# EAGLE board breakout_spartan6 (EAGLE 5.12)
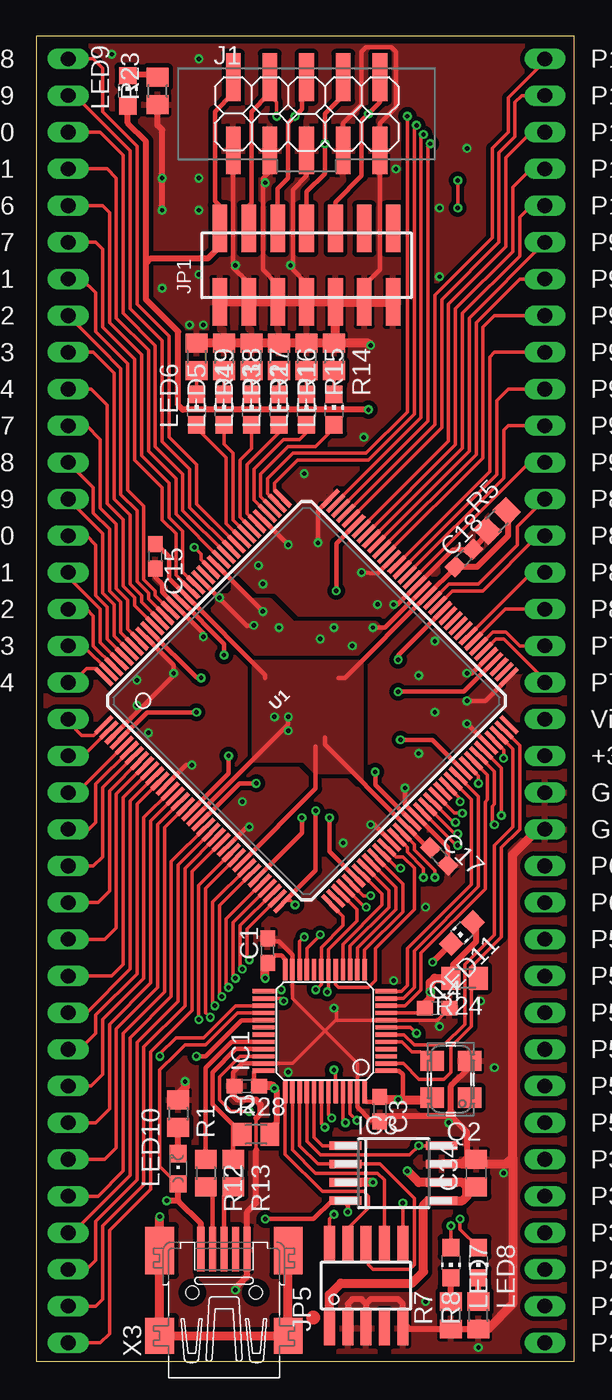
[diagram p4: board, top side]
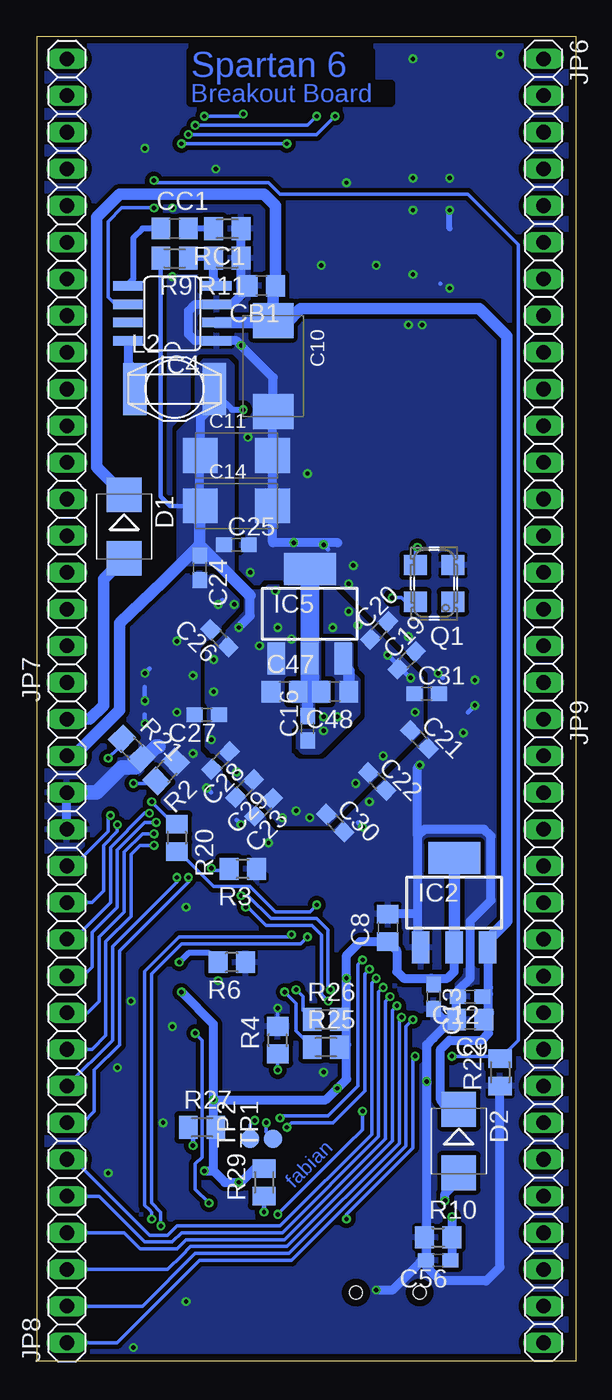
[diagram p5: board, bottom side, seen from below]

Size 37.29 x 91.75 mm. Coordinates in mm from the lower left corner, seen from the top.
Outline: 0,0 37.29,0 37.29,91.75 0,91.75 0,0
Copper layers (1*16): Top 0.035mm / dielectric 1.5mm / Bottom 0.035mm
Design rules "PCB-POOL": minimum track width 6mil, minimum drill 12mil, track to track 6mil, track to pad 6mil, pad to pad 6mil, via to via 6mil, smd to smd 6mil, copper to edge 20mil, drill to drill 8mil, minimum pad ring 8mil, minimum via ring 6mil, stop-mask expansion 3mil, vias tented up to drill 0mil, thermal gap 8mil

## Footprints (pad centres in the part's own frame; a part is rotated, then mirrored left to right if it is on the bottom)
C0603 = smd 1.1 x 1: 1 -0.85,0; 2 0.85,0
C0805 = smd 1.3 x 1.5: 1 -0.95,0; 2 0.95,0
SMC_D = smd 2.4 x 2.8: + -3.15,0; - 3.15,0
SMC_C = smd 2.4 x 2.4: + -2.5,0; - 2.5,0
SMB = smd 2.4 x 2.4: A 2.2,0; C -2.2,0
TQFP48 = smd 0.3 x 1.5: 1 -2.75,-4.25; 2 -2.25,-4.25; 3 -1.75,-4.25; 4 -1.25,-4.25; 5 -0.75,-4.25; 6 -0.25,-4.25; 7 0.25,-4.25; 8 0.75,-4.25; 9 1.25,-4.25; 10 1.75,-4.25; 11 2.25,-4.25; 12 2.75,-4.25; 25 2.75,4.25; 26 2.25,4.25; 27 1.75,4.25; 28 1.25,4.25; 29 0.75,4.25; 30 0.25,4.25; 31 -0.25,4.25; 32 -0.75,4.25; 33 -1.25,4.25; 34 -1.75,4.25; 35 -2.25,4.25; 36 -2.75,4.25 | smd 1.5 x 0.3: 13 4.25,-2.75; 14 4.25,-2.25; 15 4.25,-1.75; 16 4.25,-1.25; 17 4.25,-0.75; 18 4.25,-0.25; 19 4.25,0.25; 20 4.25,0.75; 21 4.25,1.25; 22 4.25,1.75; 23 4.25,2.25; 24 4.25,2.75; 37 -4.25,2.75; 38 -4.25,2.25; 39 -4.25,1.75; 40 -4.25,1.25; 41 -4.25,0.75; 42 -4.25,0.25; 43 -4.25,-0.25; 44 -4.25,-0.75; 45 -4.25,-1.25; 46 -4.25,-1.75; 47 -4.25,-2.25; 48 -4.25,-2.75
SOT223 = smd 1.219 x 2.235: 1 -2.311,-3.099; 2 0,-3.099; 3 2.311,-3.099 | smd 3.6 x 2.2: 4 0,3.099
SO-08M = smd 0.6 x 2.2: 1 -1.905,-3.33; 2 -0.635,-3.33; 3 0.635,-3.33; 4 1.905,-3.33; 5 1.905,3.33; 6 0.635,3.33; 7 -0.635,3.33; 8 -1.905,3.33
SO08 = smd 0.66 x 2.032: 1 -1.905,-3.073; 2 -0.635,-3.073; 3 0.635,-3.073; 4 1.905,-3.073; 5 1.905,3.073; 6 0.635,3.073; 7 -0.635,3.073; 8 -1.905,3.073
2X05SMD = smd 1.016 x 3.302: 1 -5.08,-2.54; 2 -5.08,2.54; 3 -2.54,-2.54; 4 -2.54,2.54; 5 0,-2.54; 6 0,2.54; 7 2.54,-2.54; 8 2.54,2.54; 9 5.08,-2.54; 10 5.08,2.54
2X07M_SMD = smd 1.016 x 3.302: 1 -6,-2.54; 2 -6,2.54; 3 -4,-2.54; 4 -4,2.54; 5 -2,-2.54; 6 -2,2.54; 7 0,-2.54; 8 0,2.54; 9 2,-2.54; 10 2,2.54; 11 4,-2.54; 12 4,2.54; 13 6,-2.54; 14 6,2.54
1365-10 = smd 0.76 x 2.4: 1 -2.54,-2.95; 2 -2.54,2.95; 3 -1.27,-2.95; 4 -1.27,2.95; 5 0,-2.95; 6 0,2.95; 7 1.27,-2.95; 8 1.27,2.95; 9 2.54,-2.95; 10 2.54,2.95
1X18 = drill 1.016 long: 1 -21.59,0; 2 -19.05,0; 3 -16.51,0; 4 -13.97,0; 5 -11.43,0; 6 -8.89,0; 7 -6.35,0; 8 -3.81,0; 9 -1.27,0; 10 1.27,0; 11 3.81,0; 12 6.35,0; 13 8.89,0; 14 11.43,0; 15 13.97,0; 16 16.51,0; 17 19.05,0; 18 21.59,0
L-PISG = smd 1.6 x 3.6: 1 -2.75,0; 2 2.75,0
CHIP-LED0805 = smd 1.2 x 1.2: A 0,-1.05; C 0,1.05
CHIPLED_0805 = smd 1.2 x 1.2: A 0,-1.05; C 0,1.05
XO53_SMALL = smd 1.4 x 1.6: 1 -1.27,-1.3; 2 1.27,-1.3; 3 1.27,1.3; 4 -1.27,1.3
R0805 = smd 1.3 x 1.5: 1 -0.95,0; 2 0.95,0
M0805 = smd 1.3 x 1.6: 1 -0.95,0; 2 0.95,0
B1,27 = smd 1.27 x 1.27: TP 0,0
TQ144 = smd 1.6 x 0.3: P1 -11.1,8.75; P2 -11.1,8.25; P3 -11.1,7.75; P4 -11.1,7.25; P5 -11.1,6.75; P6 -11.1,6.25; P7 -11.1,5.75; P8 -11.1,5.25; P9 -11.1,4.75; P10 -11.1,4.25; P11 -11.1,3.75; P12 -11.1,3.25; P13 -11.1,2.75; P14 -11.1,2.25; P15 -11.1,1.75; P16 -11.1,1.25; P17 -11.1,0.75; P18 -11.1,0.25; P19 -11.1,-0.25; P20 -11.1,-0.75; P21 -11.1,-1.25; P22 -11.1,-1.75; P23 -11.1,-2.25; P24 -11.1,-2.75; P25 -11.1,-3.25; P26 -11.1,-3.75; P27 -11.1,-4.25; P28 -11.1,-4.75; P29 -11.1,-5.25; P30 -11.1,-5.75; P31 -11.1,-6.25; P32 -11.1,-6.75; P33 -11.1,-7.25; P34 -11.1,-7.75; P35 -11.1,-8.25; P36 -11.1,-8.75; P73 11.1,-8.75; P74 11.1,-8.25; P75 11.1,-7.75; P76 11.1,-7.25; P77 11.1,-6.75; P78 11.1,-6.25; P79 11.1,-5.75; P80 11.1,-5.25; P81 11.1,-4.75; P82 11.1,-4.25; P83 11.1,-3.75; P84 11.1,-3.25; P85 11.1,-2.75; P86 11.1,-2.25; P87 11.1,-1.75; P88 11.1,-1.25; P89 11.1,-0.75; P90 11.1,-0.25; P91 11.1,0.25; P92 11.1,0.75; P93 11.1,1.25; P94 11.1,1.75; P95 11.1,2.25; P96 11.1,2.75; P97 11.1,3.25; P98 11.1,3.75; P99 11.1,4.25; P100 11.1,4.75; P101 11.1,5.25; P102 11.1,5.75; P103 11.1,6.25; P104 11.1,6.75; P105 11.1,7.25; P106 11.1,7.75; P107 11.1,8.25; P108 11.1,8.75 | smd 0.3 x 1.6: P37 -8.75,-11.1; P38 -8.25,-11.1; P39 -7.75,-11.1; P40 -7.25,-11.1; P41 -6.75,-11.1; P42 -6.25,-11.1; P43 -5.75,-11.1; P44 -5.25,-11.1; P45 -4.75,-11.1; P46 -4.25,-11.1; P47 -3.75,-11.1; P48 -3.25,-11.1; P49 -2.75,-11.1; P50 -2.25,-11.1; P51 -1.75,-11.1; P52 -1.25,-11.1; P53 -0.75,-11.1; P54 -0.25,-11.1; P55 0.25,-11.1; P56 0.75,-11.1; P57 1.25,-11.1; P58 1.75,-11.1; P59 2.25,-11.1; P60 2.75,-11.1; P61 3.25,-11.1; P62 3.75,-11.1; P63 4.25,-11.1; P64 4.75,-11.1; P65 5.25,-11.1; P66 5.75,-11.1; P67 6.25,-11.1; P68 6.75,-11.1; P69 7.25,-11.1; P70 7.75,-11.1; P71 8.25,-11.1; P72 8.75,-11.1; P109 8.75,11.1; P110 8.25,11.1; P111 7.75,11.1; P112 7.25,11.1; P113 6.75,11.1; P114 6.25,11.1; P115 5.75,11.1; P116 5.25,11.1; P117 4.75,11.1; P118 4.25,11.1; P119 3.75,11.1; P120 3.25,11.1; P121 2.75,11.1; P122 2.25,11.1; P123 1.75,11.1; P124 1.25,11.1; P125 0.75,11.1; P126 0.25,11.1; P127 -0.25,11.1; P128 -0.75,11.1; P129 -1.25,11.1; P130 -1.75,11.1; P131 -2.25,11.1; P132 -2.75,11.1; P133 -3.25,11.1; P134 -3.75,11.1; P135 -4.25,11.1; P136 -4.75,11.1; P137 -5.25,11.1; P138 -5.75,11.1; P139 -6.25,11.1; P140 -6.75,11.1; P141 -7.25,11.1; P142 -7.75,11.1; P143 -8.25,11.1; P144 -8.75,11.1
32005-201 = smd 3.1 x 0.5: 1 3,1.6; 2 3,0.8; 3 3,0; 4 3,-0.8; 5 3,-1.6 | smd 2.5 x 2: M1 -3,-4.45; M2 -3,4.45 | smd 3.3 x 2: M3 2.9,4.45; M4 2.9,-4.45 | hole 0.9: 0,2.2; 0,-2.2

## Placement (x,y rotation side)
C1  100n  [C0603]  16.03,28.42 90 top
C2  100n  [C0603]  14.6,19.05 180 top
C3  100n  [C0603]  23.81,17.46 270 top
C4  100n  [C0603]  27.78,24.45 0 top
C8  1µ  [C0805]  13.02,30 90 bottom
C9  1µ  [C0805]  7.3,23.65 180 bottom
C10  22µ  [SMC_D]  20.95,68.9 270 bottom
C11  22µ  [SMC_C]  23.49,62.71 0 bottom
C12  100n  [C0603]  7.3,25.24 180 bottom
C13  100n  [C0603]  9.84,25.24 270 bottom
C14  22µ  [SMC_C]  23.49,59.21 0 bottom
C15  100n  [C0603]  8.26,55.72 270 top
C16  100n  [C0603]  18.57,43.82 90 bottom
C17  100n  [C0603]  27.92,34.94 315 top
C18  100n  [C0603]  29.64,55.61 45 top
C19  100n  [C0603]  11.7,48.53 45 bottom
C20  100n  [C0603]  13.61,50.59 45 bottom
C21  100n  [C0603]  10.81,43.04 315 bottom
C22  100n  [C0603]  13.75,40.14 315 bottom
C23  100n  [C0603]  21.62,38.35 225 bottom
C24  100n  [C0603]  26.03,54.93 270 bottom
C25  100n  [C0603]  23.5,56.52 0 bottom
C26  100n  [C0603]  24.68,50.05 135 bottom
C27  100n  [C0603]  25.56,44.77 180 bottom
C28  100n  [C0603]  24.61,41.59 225 bottom
C29  100n  [C0603]  22.93,39.65 225 bottom
C30  100n  [C0603]  16.65,37.26 315 bottom
C31  100n  [C0603]  10.32,46.2 0 bottom
C34  100n  [C0805]  30.48,13.02 90 top
C47  4µ7  [C0805]  20.16,46.35 0 bottom
C48  1µ  [C0805]  16.67,46.35 180 bottom
C56  10n  [C0603]  9.52,6.99 180 bottom
CB1  100n  [C0805]  21.75,74.45 180 bottom
CC1  6n8  [C0805]  27.78,78.42 0 bottom
D1  MBRS140  [SMB]  31.27,57.79 270 bottom
D2  MBRS140  [SMB]  8.1,15.24 270 bottom
IC1  STM32F10XCXT6  [TQFP48]  20,22.86 90 top
IC2  LM1117  [SOT223]  8.41,31.75 0 bottom
IC3  AT45DB161D-SU  [SO-08M]  24.77,13.02 270 top
IC4  NCP3170  [SO08]  27.94,72.55 90 bottom
IC5  MCP1825S-1202E/DB  [SOT223]  18.42,51.75 0 bottom
J1  XILINX_JTAGSMD  [2X05SMD]  18.73,86.36 0 top
JP1  [2X07M_SMD]  18.73,75.88 0 top
JP5  CORTEX_JTAG_1.27  [1365-10]  22.86,5.24 0 top
JP6  [1X18]  2.22,68.58 270 bottom
JP7  [1X18]  35.24,68.58 90 bottom
JP8  [1X18]  35.24,22.86 90 bottom
JP9  [1X18]  2.22,22.86 270 bottom
L2  4µ7  [L-PISG]  27.78,67.31 0 bottom
LED1  red  [CHIP-LED0805]  20.64,65.88 0 top
LED2  red  [CHIP-LED0805]  18.73,65.88 0 top
LED3  red  [CHIP-LED0805]  16.83,65.88 0 top
LED4  red  [CHIP-LED0805]  14.92,65.88 0 top
LED5  red  [CHIP-LED0805]  13.02,65.88 0 top
LED6  red  [CHIP-LED0805]  11.11,65.88 0 top
LED7  green  [CHIP-LED0805]  28.73,6.83 180 top
LED8  red  [CHIP-LED0805]  30.64,6.83 180 top
LED9  green  [CHIP-LED0805]  6.35,87.95 0 top
LED10  blue  [CHIPLED_0805]  9.84,13.34 0 top
LED11  green  [CHIP-LED0805]  29.51,29.64 135 top
Q1  50.000  [XO53_SMALL]  9.8,53.84 90 bottom
Q2  8.000  [XO53_SMALL]  28.73,19.53 90 top
R1  [R0805]  9.84,17.14 270 top
R2  10k  [R0805]  28.37,40.85 225 bottom
R3  10k  [R0805]  23.07,34.08 180 bottom
R4  10k  [R0805]  20.64,22.23 90 bottom
R5  1k  [R0805]  31.93,58.18 45 top
R6  330  [R0805]  23.81,27.62 180 bottom
R7  330  [R0805]  28.73,3.17 90 top
R8  330  [R0805]  30.64,3.17 90 top
R9  24k9  [M0805]  27.78,76.36 180 bottom
R10  1M  [R0805]  9.52,8.57 0 bottom
R11  8k06  [M0805]  24.13,76.36 180 bottom
R12  22  [R0805]  11.75,13.02 270 top
R13  22  [R0805]  13.65,13.02 270 top
R14  330  [R0805]  20.64,69.53 270 top
R15  330  [R0805]  18.73,69.53 270 top
R16  330  [R0805]  16.83,69.53 270 top
R17  330  [R0805]  14.92,69.53 270 top
R18  330  [R0805]  13.02,69.53 270 top
R19  330  [R0805]  11.11,69.53 270 top
R20  10k  [R0805]  27.62,36.23 270 bottom
R21  10k  [R0805]  30.75,42.43 315 bottom
R22  10k  [M0805]  5.24,20 90 bottom
R23  330  [R0805]  8.41,87.95 90 top
R24  330  [M0805]  29.69,26.51 180 top
R25  4k7  [M0805]  17.3,21.75 0 bottom
R26  4k7  [M0805]  17.3,23.65 0 bottom
R27  4k7  [M0805]  25.88,16.19 0 bottom
R28  1k5  [M0805]  15.24,15.72 0 top
R29  10k  [M0805]  21.59,12.38 90 bottom
RC1  4k99  [M0805]  24.13,78.42 180 bottom
TP1  PTR1B1,27  [B1,27]  20.96,15.4 90 bottom
TP2  PTR1B1,27  [B1,27]  22.54,15.4 90 bottom
U1  6SLX9TQG144  [TQ144]  18.73,45.72 45 top
X3  MINI-USB  [32005-201]  13.02,4.76 90 top

## Tracks (layer width: path | path; a pad name or v marks a point on that pad's centre or on a via)
!RESET  (via drill 0.3)
  Top 0.254: IC1.7 25.94,23.11 v26.35,22.7 | JP5.10 v25.4,10.95
  Bottom 0.254: v26.35,22.7 25.88,22.23 25.88,14.13 26.35,13.65 26.35,11.91 v25.4,10.95 | v26.35,22.7
+3V3  (via drill 0.3)
  Top 0.254: U1.P36 17.3,31.91 17.62,31.91 v17.94,31.59
  Top 0.305: U1.P18 13.33,40.68 v13.33,41.91 | U1.P4 7.69,44.93 v11.11,44.93 | U1.P135 11.11,47.33 v11.43,47.31 | U1.P36 19.37,33.98 v19.37,38.1 | U1.P31 18.42,36.56 v18.42,37.62 | U1.P42 20.32,35.29 v20.32,37.62 | U1.P20 14.08,40.01 v15.24,40.01 | U1.P129 13.02,49.67 v13.02,48.9 | U1.P125 14.6,50.91 v15.08,50.96 | U1.P122 14.14,53.5 v15.72,51.91 | U1.P103 20.8,56.62 v20.8,53.34 | U1.P90 24.17,50.8 v23.34,50.8 | U1.P86 25.08,48.89 v25.08,48.58 | U1.P76 29.62,46.35 v25.08,46.35 | U1.P53 23.49,39.9 v23.49,40.8 | U1.P63 27.44,43.02 v25.24,43.02 | JP1.2 12.73,79.06 12.73,79.98 12.38,80.33 12.38,86.52 13.65,87.79 J1.2
  Top 0.406: v23.02,65.88 10.16,65.88 9.84,66.2 9.84,71.28 7.62,73.5 7.62,76.04 | 7.62,76.04 7.62,78.9 7.62,80.17 7.62,84.45 6.35,85.72 LED9.A | JP1.2 12.7,78.39 12.7,77.15 11.91,76.36 7.94,76.36 7.62,76.04 | 12.7,79.69 12.7,79.06 12.73,79.06
  Bottom 0.254: v17.94,31.59 18.42,31.11 20.8,31.11 22.54,32.86 25.08,32.86 27.46,35.24 R20.2 | Q1.4 11.62,52.41 12.07,52.86 v12.7,52.86
  Bottom 0.305: v11.43,47.31 v13.02,48.9 | C14.+ 28.1,59.21 28.73,59.85 28.73,75.41 28.73,75.88 R9.2
  Bottom 0.406: L2.2 25.03,67.1 23.81,65.88 v23.02,65.88
  Bottom 0.61: 34.77,41.91 JP8.17 | 26.03,59.17 C14.+ 26.03,59.21 | 26.03,59.21 | 26.03,59.21 26.03,62.67 C11.+ 25.99,65.29 25.24,66.04 25.24,67.1 L2.2 | v23.34,50.8 22.54,51.59 22.54,53.02
  Bottom 0.813: 34.77,41.91 33.02,43.66 31.59,45.09 31.59,51.12 28.57,53.98 26.03,56.52 | 22.54,53.02 26.03,56.52 | 26.03,56.52 26.03,59.17
  other vias: 16.83,50.8 19.69,50.01 21.91,49.53 20.64,50.8
  pour Bottom (isolate 0.305, rank 2, no thermals): 17.15,37.15 10.64,43.66 10.64,47.31 16.67,53.34 20.16,53.34 20.48,53.66 21.27,53.66 21.59,53.34 22.7,53.34 22.86,53.18 22.86,51.91 25.56,49.05 25.56,42.55 20.48,37.15
  pour Bottom (isolate 0.305, no thermals): 23.81,68.9 24.13,69.22 25.72,69.22 25.72,69.22 26.19,68.74 26.19,65.56 27.46,64.29 27.46,61.91 27.46,61.44 27.46,61.12 27.46,60.17 27.46,59.21 27.46,55.25 27.3,55.25 24.77,55.24 23.81,54.29 23.81,54.29 23.81,59.21 23.81,64.14
  pour Top (isolate 0.305, rank 2): 12.54,51.59 15.24,48.58 21.91,48.58 24.13,50.8 23.81,50.8 23.5,51.12 17.78,51.12 16.19,52.7 14.92,52.7 13.65,53.98 13.65,53.34 13.33,53.02 12.54,53.02 12.54,52.39 12.22,52.07 12.22,51.91
CCLK
  Top 0.254: U1.P70 33.02,42.39 33.02,36.99 31.75,35.72 31.75,29.53 29.69,27.46 29.69,23.34 28.26,21.91 26.19,21.91 25.49,22.61 IC1.6
CS  (via drill 0.3)
  Top 0.305: IC1.29 14.24,23.61 11.75,21.11 v11.11,21.11 | v15.87,9.84 19.21,9.84 20.48,11.11 21.27,11.11 | 21.27,11.11 IC3.4 | 21.27,11.11 21.59,10.79 v21.59,10.32
  Bottom 0.254: v15.87,9.84 15.87,10.16 11.27,14.76 11.27,20.95 v11.11,21.11
  Bottom 0.305: 21.59,10.79 v21.59,10.32 R29.1 21.59,11.27 IC3.4
CSI_B  (via drill 0.3)
  Top 0.254: U1.P64 30.64,40.53 v30.64,40.01
  Bottom 0.254: v30.64,40.01 | R2.2 29.37,40.01 v30.64,40.01
D0
  Top 0.254: IC1.10 25.56,24.61 26.67,25.72 26.67,28.26 31.12,32.7 31.12,38.73 31.27,38.89 31.27,40.6 U1.P65
D1
  Top 0.254: IC1.11 25.43,25.11 26.19,25.88 26.19,28.42 30.64,32.86 30.64,39.12 U1.P62
D2
  Top 0.254: IC1.12 25.29,25.61 25.72,26.04 25.72,28.57 30.16,33.02 30.16,38.89 U1.P61
D3
  Top 0.254: IC1.13 22.75,28.47 25.4,31.11 25.4,33.04 U1.P46
D4
  Top 0.254: IC1.14 22.25,28.6 24.92,31.27 24.92,32.81 U1.P45
D5
  Top 0.254: IC1.15 21.75,28.74 24.45,31.43 24.45,32.58 U1.P44
D6
  Top 0.254: IC1.16 21.25,28.87 23.97,31.59 23.97,32.35 U1.P43
D7
  Top 0.254: IC1.17 20.75,26.08 20.96,25.88 23.02,25.88 23.49,26.35 23.49,28.57 26.19,31.27 26.19,34.14 25.4,34.92 24.93,34.92 U1.P48
DONE
  Top 0.254: U1.P71 33.5,42.62 33.5,36.83 32.23,35.56 32.23,29.37 30.16,27.3 30.16,26.35 | 30.16,26.35 30.16,23.18 28.73,21.75 28.73,20 28.26,19.53 26.51,19.53 25.43,20.61 IC1.2 | R24.1 30.32,26.51 30.16,26.35
GND  (via drill 0.3)
  Top 0.254: v17.46,56.54 17.46,56.52 | IC1.35 17.75,20.61 20,22.86 | IC1.47 22.25,20.61 20,22.86 | 20.75,23.61 IC1.8 27.79,23.61 C4.2 | 20,22.86 20.75,23.61 | IC1.23 17.75,25.11 20,22.86 | 15.24,14.61 15.24,16.83 | 30.03,20.35 Q2.2 | v20.64,24.45 20.8,24.29 20.8,23.65 20.75,23.61 | R19.1
  Top 0.305: U1.P25 14.6,37 v14.76,36.99 | U1.P13 10.4,41.27 v10.8,41.27 | 9.52,47.94 v9.52,47.63 9.52,47.47 U1.P3 7.14,45.09 v6.99,45.4 | U1.P136 9.52,48.21 9.52,47.94 | v11.59,50.16 11.59,50.39 9.85,52.13 U1.P130 8.73,53.25 8.73,53.82 8.25,54.29 8.1,54.77 8.26,54.61 C15.2 | U1.P113 v17.46,56.54 | U1.P108 19.53,58.89 v19.53,56.67 | U1.P96 23.65,54.53 v22.54,54.61 | v24.76,52.39 25.05,52.39 U1.P91 28.87,56.21 C18.2 | U1.P77 30.18,47.62 v29.85,47.62 | U1.P68 29.85,44.15 v29.85,44.13 | U1.P49 23.42,37.15 v23.18,37.15 | IC1.23 17.75,28.13 16.83,29.05 16.25,29.05 C1.2 | IC1.35 14.26,20.61 13.65,20 13.65,19.37 13.97,19.11 C2.2 13.65,18.99 | IC1.47 22.25,17.59 23.18,16.67 23.76,16.67 C3.2 | 30.15,45.72 v29.85,45.72 31.11,45.72 U1.P73 | v25.56,39.69 25.56,38.54 U1.P54 28.52,35.58 C17.2 | J1.1 13.65,75.72 14.6,74.77 14.6,73.47 JP1.3 | J1.3 16.19,82.39 15.72,81.92 15.72,75.56 16.67,74.61 16.67,73.41 JP1.5 | J1.5 18.73,82.07 17.78,81.12 17.78,75.56 18.73,74.61 JP1.7 | 20.8,74.61 20.8,73.41 JP1.9 | JP1.11 22.7,73.38 CB1.2 23.81,75.57 J1.9 23.81,85.72 24.92,86.84 24.92,90.65 24.61,90.96 22.86,90.96 22.54,90.65 22.54,87 21.27,85.72 J1.7
  Top 0.406: 15.24,14.61 15.24,12.06 15.24,10.95 14.62,10.33 X3.5 14.62,6.04 14.6,5.87 13.81,5.08 v13.81,4.92 | 15.24,16.83 15.56,17.14 15.56,17.78 15.24,18.1 13.97,18.1 13.65,18.41 13.65,18.99 | 30.03,20.35 28.73,19.05 28.73,16.99 | 28.73,16.99 24.19,16.99 C3.2 | IC3.7 | 29.53,13.65 29.85,13.97 29.85,15.88 28.73,16.99 | R8.1 R7.1 25.88,2.22 25.65,2.45 JP5.9 25.4,3.97 25.08,4.29 23.18,4.29 22.86,3.97 | JP5.3 21.59,3.97 21.91,4.29 22.54,4.29 22.86,3.97 | 22.86,3.97 JP5.5 | v8.73,79.69 8.73,85.25 8.41,85.57 R23.1 | C18.2 30.24,56.28 31.43,57.47
  Top 0.61: v10.32,19.37 10.32,18.89 9.84,18.41 R1.1 | R8.1 31.28,2.23 33.02,3.97 33.02,14.13 | 33.02,14.13 33.02,35.08 34.77,36.83 JP8.15 | C34.2 29.84,13.97 29.53,13.65 | 29.53,13.65 IC3.7 | 29.53,13.65 30.16,13.65 C34.2 30.64,13.97 30.96,13.65 32.54,13.65 33.02,14.13 | R19.1 R18.1 12.86,70.48 R17.1 | R17.1 | R16.1 R17.1 | R16.1 | R16.1 R15.1 R14.1 | 24.76,73.34 JP1.13 JP1.11 JP1.9 | JP1.9 JP1.7 JP1.5 JP1.3 JP1.1 | JP1.9 20.73,70.74 R14.1 | v23.18,70.33 23.02,70.48 R14.1
  Bottom 0.254: v20.64,24.45 R4.2 | 32.54,40.01
  Bottom 0.305: v29.85,47.62 29.53,47.94 | v24.76,52.39 24.45,52.7 | v22.54,54.61 22.7,54.45 | 22.7,54.45 | v19.53,56.67 18.57,56.67 | v17.46,56.54 17.14,56.22 17.14,56.2 | v11.59,50.16 11.43,49.85 | v9.52,47.63 9.21,47.31 | v6.99,45.4 7.46,44.93 | v10.8,41.27 11.11,40.96 | v14.76,36.99 15.08,37.31 | v23.18,37.15 23.49,37.47 | v25.56,39.69 25.24,39.37 | 25.24,39.37 | v29.85,44.13 29.85,44.77 | 29.85,44.77 | v29.85,45.72 29.85,46.67 | 9.37,74.61
  Bottom 0.406: 8.73,78.42 v8.73,79.69 | R6.1 22.54,27.62
  Bottom 0.61: v13.81,4.92 12.7,4.92 10.8,6.83 10.32,6.99 | 10.32,6.99 10.32,8.57 | 10.32,8.57 10.64,8.73 10.32,8.73 10.32,13.34 10.32,13.65 v10.32,19.37 10.32,19.21 10.32,21.91 9.84,22.38 8.57,23.65 C9.2 | 10.32,8.57 R10.1 | 10.32,6.99 10.48,6.99 C56.2 10.32,6.93 10.32,6.51 9.37,5.56 6.19,5.56 5.24,6.51 R22.1 | JP8.15 JP8.16 | C9.2 8.41,23.65 | 8.41,23.65 | 8.41,23.65 | 8.41,23.65 8.25,23.81 8.25,25.14 C12.2 8.15,25.66 7.3,26.51 7.3,30.48 5.87,31.91 5.87,36.35 6.35,36.83 10.48,36.83 10.95,36.35 | 10.95,36.35 10.95,30.96 | 10.95,30.96 10.95,28.88 IC2.1 | C13.2 9.84,24.29 9.21,23.65 C9.2 | C9.2 | C8.2 10.96,30.95 10.95,30.96 | 10.95,36.35 10.95,41.12 v10.8,41.27 | IC4.3 26.35,73.18 26.83,72.71 26.83,71.12 26.35,70.64 25.88,70.64 IC4.1 23.49,70.64 v23.18,70.33 20.95,68.1 C10.- 20.99,65.71 C11.- C14.- 20.99,56.67 v19.53,56.67 16.47,56.67 | IC4.3 | IC4.3 23.81,73.18 23.18,73.82 23.18,74.61 | 23.18,74.61 23.18,75.72 R11.1 RC1.1 | CB1.2 23.02,74.45 23.18,74.61 | v11.59,50.16
  Bottom 0.813: C16.2 18.57,46.2 18.42,46.35
  Bottom 1.016: JP8.16 33.18,39.37 32.54,40.01 32.07,40.48 31.43,41.12 30.48,41.12 30,41.59 29.05,42.55 28.88,42.55
  Bottom 1.27: 18.42,54.62 IC5.2 18.42,46.35 | 18.42,46.35 C47.2 | 18.42,46.35 C48.2
  other vias: 8.73,74.3 6.99,47.16 7.78,43.5 14.29,38.74 21.27,35.88 26.51,42.08 27.62,44.93 27.62,49.85 26.51,47.47 15.4,55.09 23.65,52.39 28.57,16.51 27.94,23.18 26.99,4.13 30.64,0.95 24.77,26.35 26.99,31.43 30.8,24.92 32.38,13.02 31.75,20.32 22.7,63.98 27.94,75.09 8.73,81.92 29.85,83.98 24.92,82.55 11.27,90.17 15.87,81.6 15.72,53.82 27.94,79.85 18.57,61.46 10.64,71.75 13.81,75.88 17.62,75.88 11.59,71.75 11.27,75.25 11.27,79.69 11.27,81.92 5.24,90.49 17.46,20
  pour Top (isolate 0.305, rank 6): 16.51,20 17.14,19.37 22.86,19.37 23.5,20 23.5,25.72 22.86,26.35 17.14,26.35 16.51,25.72
  pour Top (isolate 0.305, rank 6): 4.92,45.24 4.92,46.2 18.26,59.53 19.21,59.53 19.37,59.37 32.38,46.35 32.38,45.09 19.21,31.91 18.26,31.91
  pour Bottom (isolate 0.305, rank 6, no thermals): 6.19,44.13 6.19,47.47 12.7,53.98 12.7,55.72 13.02,56.04 14.76,56.04 16.35,57.47 20,57.47 21.27,57.47 24.45,54.29 26.67,54.29 30.64,50.32 30.64,50.16 30.64,48.1 30.64,43.34 19.21,31.91 18.26,31.91
  pour Bottom (isolate 0.305, rank 6): -1.59,93.98 39.05,93.98 39.05,-1.27 -1.59,-1.27
  pour Bottom (isolate 0.305, rank 6, no thermals): 19.21,66.83 19.21,66.83 19.69,67.31 22.07,67.31 22.54,66.83 22.54,64.61 23.02,64.14 23.02,63.66 22.54,63.18 22.54,55.72 20,56.67 19.21,57.47
  pour Top (isolate 0.305, rank 6): -3.02,95.41 40.32,95.41 40.32,-2.7 -3.02,-2.7
INIT_B  (via drill 0.3)
  Top 0.254: U1.P39 22.23,31.27 22.23,30.48 20.25,28.51 IC1.18 20.25,25.65 v20.16,25.56
  Bottom 0.254: v20.16,25.56 19.37,24.77 19.37,22.86 R25.1
M0  (via drill 0.3)
  Top 0.254: U1.P69 32.39,42.32 v32.39,41.75
  Bottom 0.254: v32.39,41.75 31.71,42.43 U1.P69 31.53,43 R21.1
M1  (via drill 0.3)
  Top 0.254: U1.P60 29.37,38.97 v29.37,38.73
  Bottom 0.254: v29.37,38.73 28.29,37.66 R20.1
N$1  (via drill 0.3)
  Top 0.254: U1.P107 26.67,65.33 26.67,84.77 v26.83,84.93 | v16.67,86.2 16.67,87.15 16.11,87.71
  Top 0.305: JP1.4 14.73,79.98 14.92,80.17 14.92,86.52 16.11,87.71 16.19,87.79 J1.4
  Bottom 0.254: v26.83,84.93 17.94,84.93 v16.67,86.2
N$2  (via drill 0.3)
  Top 0.254: U1.P109 16.51,60.32 16.51,60.8 18.1,62.39 23.02,62.39 26.19,65.56 26.19,66.52 26.19,84.93 26.19,85.41 v26.35,85.57
  Top 0.305: JP1.6 16.73,81.19 17.46,81.92 17.46,85.72 v17.94,86.2 | v17.94,86.2 | v17.94,86.2 18.42,86.68 18.42,87.47 18.73,87.79 J1.6
  Bottom 0.254: v26.35,85.57 18.89,85.57 18.57,85.57 v17.94,86.2
N$3  (via drill 0.3)
  Top 0.254: U1.P106 27.15,65.09 27.15,84.14 v27.3,84.3
  Top 0.305: JP1.8 18.73,80.96 20,82.23 v20,84.3 20,86.36 21.27,87.63 J1.8
  Bottom 0.254: v27.3,84.3 v20,84.3
N$4  (via drill 0.3)
  Top 0.254: U1.P110 16.03,60.09 16.03,61.12 | 16.03,61.12 | 16.03,61.12 17.78,62.87 22.86,62.87 25.72,65.72 v25.72,86.2
  Top 0.305: JP1.10 20.73,80.26 22.54,82.07 22.54,85.88 v23.02,86.36 23.81,87.15 J1.10 23.81,89.38
  Bottom 0.254: v25.72,86.2 23.18,86.2 v23.02,86.36
N$5  (via drill 0.3)
  Top 0.254: IC1.44 20.75,20.05 v20.64,20.16
  Bottom 0.254: 20.64,20.48 v20.64,20.16 R4.1
N$6
  Top 0.406: LED9.C 6.35,89.06 8.25,89.06 R23.2
N$7  (via drill 0.3)
  Top 0.406: LED11.C 28.74,28.9 v27.46,27.62
  Bottom 0.406: R6.2 25.4,28.26 26.83,28.26 v27.46,27.62
N$16
  Top 0.305: X3.2 12.22,11.91 R12.2
N$17
  Top 0.305: X3.3 13.02,11.43 R13.2
N$30  (via drill 0.3)
  Top 0.254: IC1.45 21.25,16.69 v21.43,16.51
  Bottom 0.254: v21.43,16.51 21.43,15.88 TP1.TP
N$31  (via drill 0.3)
  Top 0.254: IC1.46 21.75,17.14 v22.23,16.67
  Bottom 0.254: v22.23,16.67 22.54,16.35 TP2.TP | TP2.TP
N$33
  Top 0.406: LED10.C R1.2
N$42  (via drill 0.3)
  Top 0.61: X3.M4 X3.M1 X3.M2 X3.M3 v8.57,10
  Bottom 0.61: v8.57,10 8.57,9.21 R10.2 8.57,6.93 C56.1
N$44
  Bottom 0.406: RC1.2 CC1.2
N$45
  Bottom 0.406: IC4.5 31.01,74.56 30.64,74.93 30.64,76.99 30.64,77.79 30,78.42 29.21,78.42 | 29.21,78.42 | CC1.1 29.21,78.42 | CC1.1
N$46
  Bottom 0.61: L2.1 30.53,68.63 30.96,69.06 30.96,70.59 IC4.8
N$47
  Bottom 0.406: R11.2 R9.1
  Bottom 0.61: IC4.4 24.61,74.45 25.08,74.93 R11.2
N$48  (via drill 0.3)
  Top 0.254: IC1.21 18.75,28.59 v19.69,29.53 | v29.37,9.84 29.37,9.15 LED8.A
  Bottom 0.254: v19.69,29.53 | v19.69,29.53 19.84,29.37 27.46,29.37 29.85,26.99 29.85,10.79 29.53,10.48 29.37,10.32 v29.37,9.84
N$49  (via drill 0.3)
  Top 0.254: IC1.22 18.25,29.05 v18.57,29.37 | LED7.A v28.73,9.37
  Bottom 0.254: v18.57,29.37 19.05,28.89 27.31,28.89 29.37,26.83 29.37,10.95 28.73,10.32 v28.73,9.37
N$50
  Top 0.406: R7.2 LED7.C
N$51
  Top 0.406: R8.2 LED8.C | LED8.C
N$52
  Top 0.254: LED1.C R14.2
N$53
  Bottom 0.813: JP8.18 33.66,44.45 32.7,45.4 32.7,54.16 D1.A
N$54
  Top 0.254: LED2.C R15.2
N$55
  Top 0.254: LED3.C R16.2
N$56
  Top 0.254: LED4.C R17.2
N$57
  Top 0.254: LED5.C R18.2
N$58
  Top 0.254: LED6.C R19.2
P1
  Top 0.254: U1.P1 3.98,43.34 3.18,43.34 2.22,44.29 JP9.1
P2
  Top 0.254: U1.P2 3.26,41.91 JP9.2
P5
  Top 0.254: U1.P5 2.84,39.37 JP9.3
P6
  Top 0.254: U1.P6 4.13,39.95 4.13,37.31 3.65,36.83 JP9.4
P7
  Top 0.254: U1.P7 4.6,39.72 4.6,34.92 3.97,34.29 JP9.5
P8
  Top 0.254: U1.P8 5.08,39.49 5.08,32.54 4.29,31.75 JP9.6
P9
  Top 0.254: U1.P9 5.56,39.26 5.56,30 4.76,29.21 JP9.7
P10
  Top 0.254: U1.P10 6.03,39.03 6.03,27.46 5.24,26.67 | 5.24,26.67 | JP9.8 5.24,26.67
P11
  Top 0.254: U1.P11 6.51,38.8 6.51,27.15 3.49,24.13 JP9.9
P12
  Top 0.254: U1.P12 6.99,38.57 6.99,26.83 4.13,23.97 4.13,22.7 3.02,21.59 JP9.10
P14
  Top 0.254: U1.P14 7.46,37.63 7.46,26.51 4.6,23.65 4.6,19.84 3.81,19.05 JP9.11
P15
  Top 0.254: U1.P15 7.94,37.4 7.94,26.19 5.08,23.34 5.08,17.46 4.13,16.51 JP9.12
P16
  Top 0.254: U1.P16 8.41,37.17 8.41,25.88 5.56,23.02 5.56,14.76 4.76,13.97 JP9.13
P17
  Top 0.254: U1.P17 8.89,36.94 8.89,25.56 6.03,22.7 6.03,13.18 4.29,11.43 JP9.14
P21
  Top 0.254: U1.P21 9.37,34.59 9.37,25.24 6.51,22.38 6.51,12.86 2.54,8.89 JP9.15
P22
  Top 0.254: U1.P22 9.84,34.35 9.84,24.92 6.99,22.07 6.99,12.54 4.13,9.68 4.13,6.99 3.49,6.35 JP9.16
P23
  Top 0.254: U1.P23 10.32,34.12 10.32,24.61 7.46,21.75 7.46,12.22 4.6,9.37 4.6,4.29 4.13,3.81 JP9.17
P24
  Top 0.254: U1.P24 10.8,33.89 10.8,24.29 7.94,21.43 7.94,11.91 5.08,9.05 5.08,1.91 4.45,1.27 JP9.18
P26  (via drill 0.3)
  Top 0.254: U1.P26 11.27,32.96 v11.27,23.65
  Bottom 0.254: JP8.1 31.75,1.27 26.03,6.99 19.69,6.99 11.75,14.92 11.75,23.18 v11.27,23.65
P27  (via drill 0.3)
  Top 0.254: U1.P27 11.75,32.73 11.75,24.13 11.91,23.97 | 11.91,23.97 | v12.07,23.81 11.91,23.97
  Bottom 0.254: JP8.2 30,3.81 26.35,7.46 19.84,7.46 12.22,15.08 12.22,23.65 v12.07,23.81
P29  (via drill 0.3)
  Top 0.254: U1.P29 12.22,31.79 12.22,24.77 v12.38,24.61 | v12.38,24.61
  Bottom 0.254: JP8.3 28.26,6.35 27.31,7.3 27.3,7.3 26.67,7.94 25.72,7.94 25.56,7.94 20,7.94 12.7,15.24 12.7,24.29 v12.38,24.61
P30  (via drill 0.3)
  Top 0.254: U1.P30 12.7,31.56 12.7,25.4 v12.86,25.24 | v12.86,25.24
  Bottom 0.254: JP8.4 31.27,8.89 30.16,7.78 27.62,7.78 26.99,8.41 20.16,8.41 13.18,15.4 13.18,24.92 v12.86,25.24
P32  (via drill 0.3)
  Top 0.254: U1.P32 13.18,30.62 13.18,26.04 v13.33,25.88 | v13.33,25.88
  Bottom 0.254: JP8.5 33.02,11.43 29.85,8.26 27.94,8.26 27.3,8.89 20.32,8.89 13.65,15.56 13.65,25.56 v13.33,25.88
P33  (via drill 0.3)
  Top 0.254: U1.P33 13.65,30.39 13.65,26.67 v13.81,26.51 | v13.81,26.51
  Bottom 0.254: 34.77,13.97 JP8.6 | 34.77,13.97 29.53,8.73 28.26,8.73 27.62,9.37 20.48,9.37 14.13,15.72 14.13,26.19 v13.81,26.51 | 34.77,13.97
P34  (via drill 0.3)
  Top 0.254: U1.P34 14.13,30.16 14.13,27.3 v14.29,27.15 | IC1.42 19.75,16.44 v20,16.19
  Bottom 0.254: v14.29,27.15 14.6,26.83 14.6,18.73 16.83,16.51 19.69,16.51 v20,16.19
P35  (via drill 0.3)
  Top 0.254: U1.P35 14.61,29.93 14.61,28.1 14.6,28.1 14.6,27.94 v14.76,27.78 | IC1.43 20.25,17.05 v20.48,16.83
  Bottom 0.254: v14.76,27.78 15.08,27.46 15.08,19.05 17.14,16.99 20.32,16.99 v20.48,16.83
P40  (via drill 0.3)
  Top 0.254: U1.P40 22.61,31.59 v22.86,31.43 | IC1.26 16.96,25.11 v17.14,24.92
  Bottom 0.254: v22.86,31.43 22.7,31.43 21.43,30.16 18.26,30.16 17.62,29.53 17.62,25.4 17.3,25.08 v17.14,24.92
P41  (via drill 0.3)
  Top 0.254: U1.P41 22.68,32.23 v23.18,32.23 | IC1.25 16.88,25.61 v16.99,25.72
  Bottom 0.254: v23.18,32.23 22.7,32.23 21.11,30.64 17.94,30.64 17.14,29.84 17.14,29.69 17.14,25.88 v16.99,25.72 | v16.99,25.72
P50  (via drill 0.3)
  Top 0.254: U1.P50 25.72,35.55 25.72,35.24 26.83,34.12 v26.83,33.5
  Bottom 0.254: v26.83,33.5 26.83,33.66 26.83,33.18 31.59,28.42 31.59,21.91 33.34,20.16 33.34,17.3 34.13,16.51 JP8.7
P51  (via drill 0.3)
  Top 0.254: v27.62,33.5 27.62,33.97 26.19,35.4 26.19,35.78 U1.P51
  Bottom 0.254: v27.62,33.5 27.62,33.18 32.07,28.73 32.07,22.23 JP8.8
P55  (via drill 0.3)
  Top 0.254: U1.P55 28.93,35.88 v29.21,35.72
  Bottom 0.254: v29.21,35.72 30.16,35.72 30.8,35.08 30.8,31.27 30.8,30.8 32.54,29.05 32.54,22.54 33.5,21.59 JP8.9
P56  (via drill 0.3)
  Top 0.254: U1.P56 29,36.51 v29.21,36.51
  Bottom 0.254: v29.21,36.51 30,36.51 31.27,35.24 31.27,31.11 33.02,29.37 33.02,24.92 33.81,24.13 JP8.10
P57  (via drill 0.3)
  Top 0.254: U1.P57 28.91,37.31 v29.05,37.31
  Bottom 0.254: v29.05,37.31 29.85,37.31 31.75,35.4 31.75,31.43 33.5,29.69 33.5,27.3 34.13,26.67 JP8.11
P58  (via drill 0.3)
  Top 0.254: U1.P58 28.99,37.94 v29.53,37.94
  Bottom 0.254: v29.53,37.94 29.84,37.94 32.23,35.56 32.23,31.75 34.77,29.21 JP8.12
P66  (via drill 0.3)
  Top 0.254: U1.P66 31.75,40.83 31.75,38.58 31.59,38.42 31.59,37.31 v31.75,37.15
  Bottom 0.254: JP8.13 33.5,31.75 32.7,32.54 32.7,35.72 31.75,36.67 v31.75,37.15
P67  (via drill 0.3)
  Top 0.254: U1.P67 32.23,41.06 32.23,38.42 32.23,37.94 v32.23,37.78
  Bottom 0.254: JP8.14 34.77,34.29 32.39,36.67 32.39,37.62 v32.23,37.78
P78
  Top 0.254: U1.P78 31.86,50.01 32.39,50.01 35.24,47.15 JP7.1
P79
  Top 0.254: U1.P79 31.63,50.48 32.54,50.48 33.5,49.53 JP7.2
P80
  Top 0.254: U1.P80 32.51,52.07 JP7.3
P81
  Top 0.254: U1.P81 34.34,54.61 JP7.4
P87
  Top 0.254: U1.P87 28.83,53.34 30.96,53.34 34.77,57.15 JP7.5
P88
  Top 0.254: U1.P88 28.6,53.82 30.64,53.82 33.34,56.52 33.34,57.78 JP7.6 35.11,59.69
P92
  Top 0.254: U1.P92 34.18,62.23 JP7.7
P93
  Top 0.254: U1.P93 32.39,61.14 32.39,64.45 32.7,64.77 JP7.8
P94
  Top 0.254: U1.P94 31.91,61.37 31.91,66.52 32.7,67.31 JP7.9
P95
  Top 0.254: U1.P95 31.43,61.6 31.43,69.53 31.75,69.85 JP7.10
P97
  Top 0.254: U1.P97 30.96,62.54 30.96,71.6 31.75,72.39 JP7.11
P98
  Top 0.254: U1.P98 30.48,62.77 30.48,71.91 33.5,74.93 JP7.12
P99
  Top 0.254: U1.P99 30,63 30,72.23 JP7.13
P100
  Top 0.254: U1.P100 29.53,63.23 29.53,72.55 33.5,76.52 33.5,79.22 34.29,80.01 JP7.14
P101
  Top 0.254: U1.P101 29.05,63.46 29.05,72.87 33.02,76.83 33.02,81.28 34.29,82.55 JP7.15
P102
  Top 0.254: U1.P102 28.57,63.69 28.57,73.18 32.54,77.15 32.54,83.34 34.29,85.09 JP7.16
P104
  Top 0.254: U1.P104 28.1,64.63 28.1,73.5 32.07,77.47 32.07,83.66 33.18,84.77 33.18,87.15 33.65,87.63 JP7.17
P105
  Top 0.254: U1.P105 27.62,64.86 27.62,73.82 31.59,77.79 31.59,83.98 32.7,85.09 32.7,87.47 35.24,90.01 JP7.18
P111
  Top 0.254: U1.P111 15.56,59.85 15.56,61.44 17.46,63.34 19.37,63.34 20.64,64.61
  Top 0.305: 20.64,64.61 LED1.A
P112
  Top 0.254: U1.P112 15.08,59.62 15.08,61.75 17.14,63.82 18.26,63.82 18.73,64.29 LED2.A
P114
  Top 0.254: U1.P114 14.6,58.69 14.6,62.07 16.83,64.29 LED3.A
P115
  Top 0.254: U1.P115 14.13,58.45 14.13,62.39 14.92,63.18 14.92,64.45 14.92,64.77 LED4.A
P116
  Top 0.254: U1.P116 13.65,58.22 13.65,62.87 13.02,63.5 LED5.A
P117
  Top 0.254: U1.P117 13.18,57.99 13.18,62.55 11.11,64.61 LED6.A
P118
  Top 0.254: JP6.1 3.97,90.17 4.6,89.53 4.6,86.52 6.99,84.14 6.99,73.18 9.21,70.96 9.21,63.98 11.11,62.07 11.11,59.35 U1.P118
P119
  Top 0.254: 6.51,83.82 6.51,72.87 8.73,70.64 8.73,63.66 10.64,61.75 10.64,59.12 U1.P119 | 6.51,83.82 | 6.51,83.82 2.7,87.63 JP6.2
P120
  Top 0.254: JP6.3 4.45,85.09 6.03,83.5 6.03,72.55 8.25,70.33 8.25,63.34 10.16,61.44 10.16,58.89 U1.P120
P121
  Top 0.254: JP6.4 4.92,82.55 5.56,81.92 5.56,72.23 7.78,70.01 7.78,63.02 9.68,61.12 9.68,58.66 U1.P121
P123  (via drill 0.3)
  Top 0.254: U1.P123 11.43,55.5 11.43,55.88 v10.95,56.36 | v10.95,56.36
  Bottom 0.254: v10.95,56.36 | v10.95,56.36 11.11,56.2 11.11,54.96 Q1.3
P126
  Top 0.254: U1.P126 10.16,54.65 10.16,57.47 9.21,58.42 9.21,60.8 7.3,62.71 7.3,69.69 5.08,71.91 5.08,79.53 4.6,80.01 JP6.5
P127
  Top 0.254: U1.P127 9.68,54.41 9.68,57.31 8.73,58.23 8.73,60.48 6.83,62.39 6.83,69.37 4.6,71.6 4.6,76.99 4.13,77.47 JP6.6
P131
  Top 0.254: U1.P131 8.25,53.02 8.25,53.34 7.46,54.13 7.46,59.21 6.35,60.33 6.35,62.07 6.35,69.06 4.13,71.28 4.13,73.98 3.18,74.93 JP6.7
P132
  Top 0.254: U1.P132 7.78,52.78 7.78,53.18 6.99,53.98 6.99,58.9 5.87,60.01 5.87,61.75 | 5.87,61.75 | 5.87,61.75 5.87,68.74 4.45,70.17 JP6.8
P133
  Top 0.254: U1.P133 7.3,52.55 7.3,53.02 6.51,53.82 6.51,58.58 5.4,59.69 5.4,61.44 | 5.4,61.44 | 5.4,61.44 5.4,68.42 3.97,69.85 JP6.9
P134
  Top 0.254: U1.P134 6.83,52.32 6.83,52.86 6.03,53.66 6.03,58.26 4.92,59.37 4.92,66.2 3.81,67.31 JP6.10
P137
  Top 0.254: U1.P137 6.35,50.68 6.35,52.7 5.56,53.5 5.56,57.94 4.45,59.05 4.45,60.8 | 4.45,60.8 | 4.45,60.8 | 4.45,60.8 | 4.45,60.8 4.45,63.82 3.49,64.77 JP6.11
P138
  Top 0.254: U1.P138 5.87,50.45 5.87,52.55 5.08,53.34 5.08,57.63 3.97,58.74 3.97,60.48 JP6.12
P139
  Top 0.254: U1.P139 5.4,50.22 5.4,52.39 4.6,53.18 4.6,57.31 JP6.13 | JP6.13
P140
  Top 0.254: U1.P140 4.92,49.98 4.92,52.23 4.13,53.02 4.13,56.52 3.49,57.15 JP6.14
P141
  Top 0.254: U1.P141 4.45,49.75 4.45,52.07 2.22,54.29 JP6.15
P142
  Top 0.254: U1.P142 3.97,49.52 3.97,51.59 3.49,52.07 JP6.16
P143
  Top 0.254: U1.P143 3.26,49.53 JP6.17
P144
  Top 0.254: U1.P144 4.14,47.94 3.49,47.94 2.54,46.99 JP6.18
PD0
  Top 0.254: IC1.5 25.36,22.11 26.03,21.43 26.63,21.43 Q2.3
PROGRAM_B  (via drill 0.3)
  Top 0.254: U1.P37 21.27,30.81 21.27,30.16 19.75,28.64 IC1.19 19.75,26.1 v19.37,25.72
  Bottom 0.254: v19.37,25.72 18.89,25.24 18.89,24.29 R26.1
PWR_ON  (via drill 0.3)
  Top 0.254: v8.57,21.11 8.57,21.27 9.68,22.38 11.59,22.38 13.32,24.11 13.82,24.61 IC1.27 | v29.21,81.76 v29.21,79.85
  Bottom 0.254: v8.57,21.11 5.4,21.11 R22.2 3.97,22.23 3.97,77.31 7.46,80.8 20.48,80.8 21.27,81.6 29.05,81.6 v29.21,81.76 | IC4.6 31.91,73.18 32.39,73.66 32.39,78.9 31.43,79.85 v29.21,79.85 | v29.21,81.76
RDWR_B  (via drill 0.3)
  Top 0.254: U1.P47 25.02,34.13 v25.24,34.13
  Bottom 0.254: R3.2 24.02,34.02 23.97,33.97 25.07,33.98 v25.24,34.13
SPI1_MISO  (via drill 0.3)
  Top 0.254: IC1.40 18.75,15.22 19.69,14.29 25.88,14.29 v26.51,14.92 IC3.8
  Bottom 0.305: v26.51,14.92 26.51,16.19 R27.1
SPI1_MOSI
  Top 0.254: IC1.41 19.25,15.51 19.84,14.92 IC3.1
SPI1_SCK
  Top 0.254: IC1.39 18.26,14.92 19.53,13.65 IC3.2 23.81,13.65 26.19,11.27 26.19,6.67 25.88,6.35 23.34,6.35 23.02,6.67 JP5.6
TCK
  Top 0.254: JP5.4 21.59,9.21 23.02,10.64 23.02,11.43 22.7,11.75 19.84,11.75 17.25,14.34 IC1.37
TDI
  Top 0.254: IC1.38 17.75,14.63 19.37,13.02 23.65,13.02 24.13,12.54 JP5.8
TMS  (via drill 0.3)
  Top 0.254: IC1.34 14.12,21.11 12.7,19.68 12.7,18.1 13.49,17.3 v14.76,17.3 | v20.64,10.16 20.32,9.84 JP5.2
  Bottom 0.254: v14.76,17.3 14.76,16.03 15.08,15.72 15.56,15.24 v20.64,10.16
USB_DM
  Top 0.305: IC1.32 13.85,22.11 13.54,22.11 11.75,20.32 R12.1
USB_DP
  Top 0.305: R13.1 13.65,16.35 | 13.65,16.35 12.22,17.78 12.22,19.68 12.22,20 13.83,21.61 14.15,21.61 IC1.33 | R28.1 13.65,15.72 13.65,16.35
USB_VBUS  (via drill 0.3)
  Top 0.254: LED10.A 9.78,12.29 8.57,13.49 8.57,20.16 9.68,21.27 | 9.68,21.27 | 9.68,21.27 9.84,21.43 | 9.84,21.43 | 9.84,21.43 10.32,21.91 11.75,21.91 13.95,24.11 IC1.28
  Top 0.406: X3.1 11.42,9.54 9.84,11.11 | 9.84,11.11 v9.05,11.11 | 9.84,11.11 LED10.A
  Bottom 0.61: v9.05,11.11 9.07,11.11 9.05,11.59 8.1,12.54 D2.A
VCC
  Bottom 0.254: 6.03,25.86 6.03,25.88
  Bottom 0.61: D2.C 8.73,17.3 9.37,18.1 9.37,21.59 8.73,22.23 6.51,22.23 6.03,22.7 6.03,23.65 | 6.03,23.65 6.03,24.13 6.03,25.4 | 6.03,25.4 6.03,25.86 | 6.03,25.88 6.03,29.21 | 6.03,23.65 C9.1 | 6.03,23.65 | C12.1 6.19,25.24 6.03,25.4 | 21.61,71.91 C10.+ 20.95,72.21 | 20.95,74.3 CB1.1 | 31.27,60.01 D1.C
  Bottom 0.813: IC2.3 6.03,28.57 6.03,29.21 4.76,30.48 4.76,70.96 6.67,72.87 19.05,72.87 20,71.91 20.82,71.91 C10.+ | 21.61,71.91 IC4.2 | 20.95,72.21 20.95,74.3 | 31.27,60.01 33.18,61.91 33.18,79.22 31.59,80.8 21.59,80.8 20.8,80.01 CB1.1 | 6.03,24.13
VCCINT  (via drill 0.3)
  Top 0.305: 20,43.18 20,42.68 U1.P52 27.14,35.55 C17.1 | U1.P19 17.46,44.1 17.46,44.45 | U1.P28 19.37,39.64 19.37,42.55 | 15.87,47.31 15.87,47.52 U1.P128 9.21,54.18 9.21,55.72 8.52,56.41 C15.1 | 20.96,47.31 21.38,47.31 U1.P89 29.04,54.97 C18.1
  Top 0.406: C18.1 30.56,55.01 32.7,57.15 32.7,58.74 R5.2
  Bottom 0.813: C48.1 15.72,47.79 16.19,48.26 16.19,49.21
  other vias: 16.51,44.61 17.46,44.61 17.46,43.66
  pour Top (isolate 0.305, no thermals): 15.08,41.59 15.08,48.42 22.54,48.42 22.54,40.16 21.91,40.8 19.37,40.8 19.37,40.8 18.57,41.59
  pour Bottom (isolate 0.305, no thermals): 15.08,44.93 15.08,47.15 15.56,47.62 15.56,47.94 15.56,49.37 15.56,49.53 15.87,49.85 17.14,49.85 17.14,47.31 17.78,46.67 17.78,43.97 18.1,43.66 18.89,43.66 19.21,43.34 19.21,42.55 18.89,42.23 17.78,42.23
VCCIO  (via drill 0.3)
  Top 0.254: IC1.9 26.59,24.11 C4.1
  Top 0.305: IC1.24 17.25,27.83 16.99,28.1 16.57,28.1 C1.1 | IC1.48 22.75,18.05 22.86,17.94 23.44,17.94 C3.1 | IC1.36 15.19,20.11 15.08,20 15.08,19.42 C2.1 | IC1.1 25.13,20.11 25.4,19.84 25.4,18.41 v25.08,18.1
  Top 0.406: LED11.A 30.48,30.16 30.48,29.05 28.89,27.46 28.89,26.67 R24.2 | R28.2 16.19,16.03 16.67,16.51 16.67,18.73 v16.51,18.89
  Top 0.61: 29.85,12.06 29.53,12.38 | 29.85,12.06 29.85,11.43 29.53,11.11 IC3.5 27.15,11.11 26.83,10.79 26.83,6.19 26.03,5.4 21.11,5.4 20.32,4.6 JP5.1 | 29.85,12.06 C34.1 | 29.53,12.38 30.48,12.38 | C2.1 15.46,18.99 15.56,19.05 16.35,19.05 v16.51,18.89 | v25.08,18.1 | C3.1 24.03,18.1 v25.08,18.1 | v25.08,18.1 27.27,18.1 Q2.4 | C4.1 26.83,24.61 27.3,25.08 v27.3,25.56 27.3,26.19 27.62,26.51 R24.2 | C1.1 15.87,27.46 v15.88,26.51 | v23.34,12.38 IC3.3 | 29.53,12.38 IC3.6 26.51,12.38 v25.72,13.18
  Bottom 0.305: 25.08,16.19 R27.2
  Bottom 0.406: R26.2 15.88,23.65 15.88,23.5 | R25.2 15.88,21.75 15.88,21.91
  Bottom 0.61: v25.08,18.1 17.3,18.1 v16.51,18.89 15.87,19.53 15.88,21.91 15.88,23.5 v15.88,26.51 15.88,28.1 14.92,29.05 C8.1 12.38,28.42 12.38,26.99 11.91,26.51 10,26.51 | v25.08,18.1 25.08,23.34 v27.3,25.56 | 25.08,13.18 24.29,12.38 v23.34,12.38 23.18,12.38 22.23,13.33 R29.2 | 25.08,13.18 25.08,14.13 25.08,16.19 v25.08,18.1 | v25.72,13.18 25.08,13.18 | 25.08,13.18 | IC2.2 8.41,26.99 8.89,26.51 10,26.51 | C13.1 9.84,26.35 10,26.51
  Bottom 0.813: IC2.2 IC2.4
(copper drawn outside any net)
  shapes: Top circle x1

## Text on the board
Bottom: Spartan 6 | Breakout Board | fabian
tNames: P118 | P105 | P119 | P104 | P120 | P102 | P121 | P101 | P126 | P100 | P127 | P99 | P131 | P98 | P132 | P97 | P133 | P95 | P134 | P94 | P137 | P93 | P138 | P92 | P139 | P88 | P140 | P87 | P141 | P81 | P142 | P80 | P143 | P79 | P144 | P78 | P1 | Vin | P2 | +3.3V | P5 | GND | P6 | GND | P7 | P67 | P8 | P66 | P9 | P58 | P10 | P57 | P11 | P56 | P12 | P55 | P14 | P51 | P15 | P50 | P16 | P33 | P17 | P32 | P21 | P30 | P22 | P29 | P23 | P27 | P24 | P26